# EAGLE design 2_cpu_control (EAGLE 6.6.0)

## Sheet 1 of 2
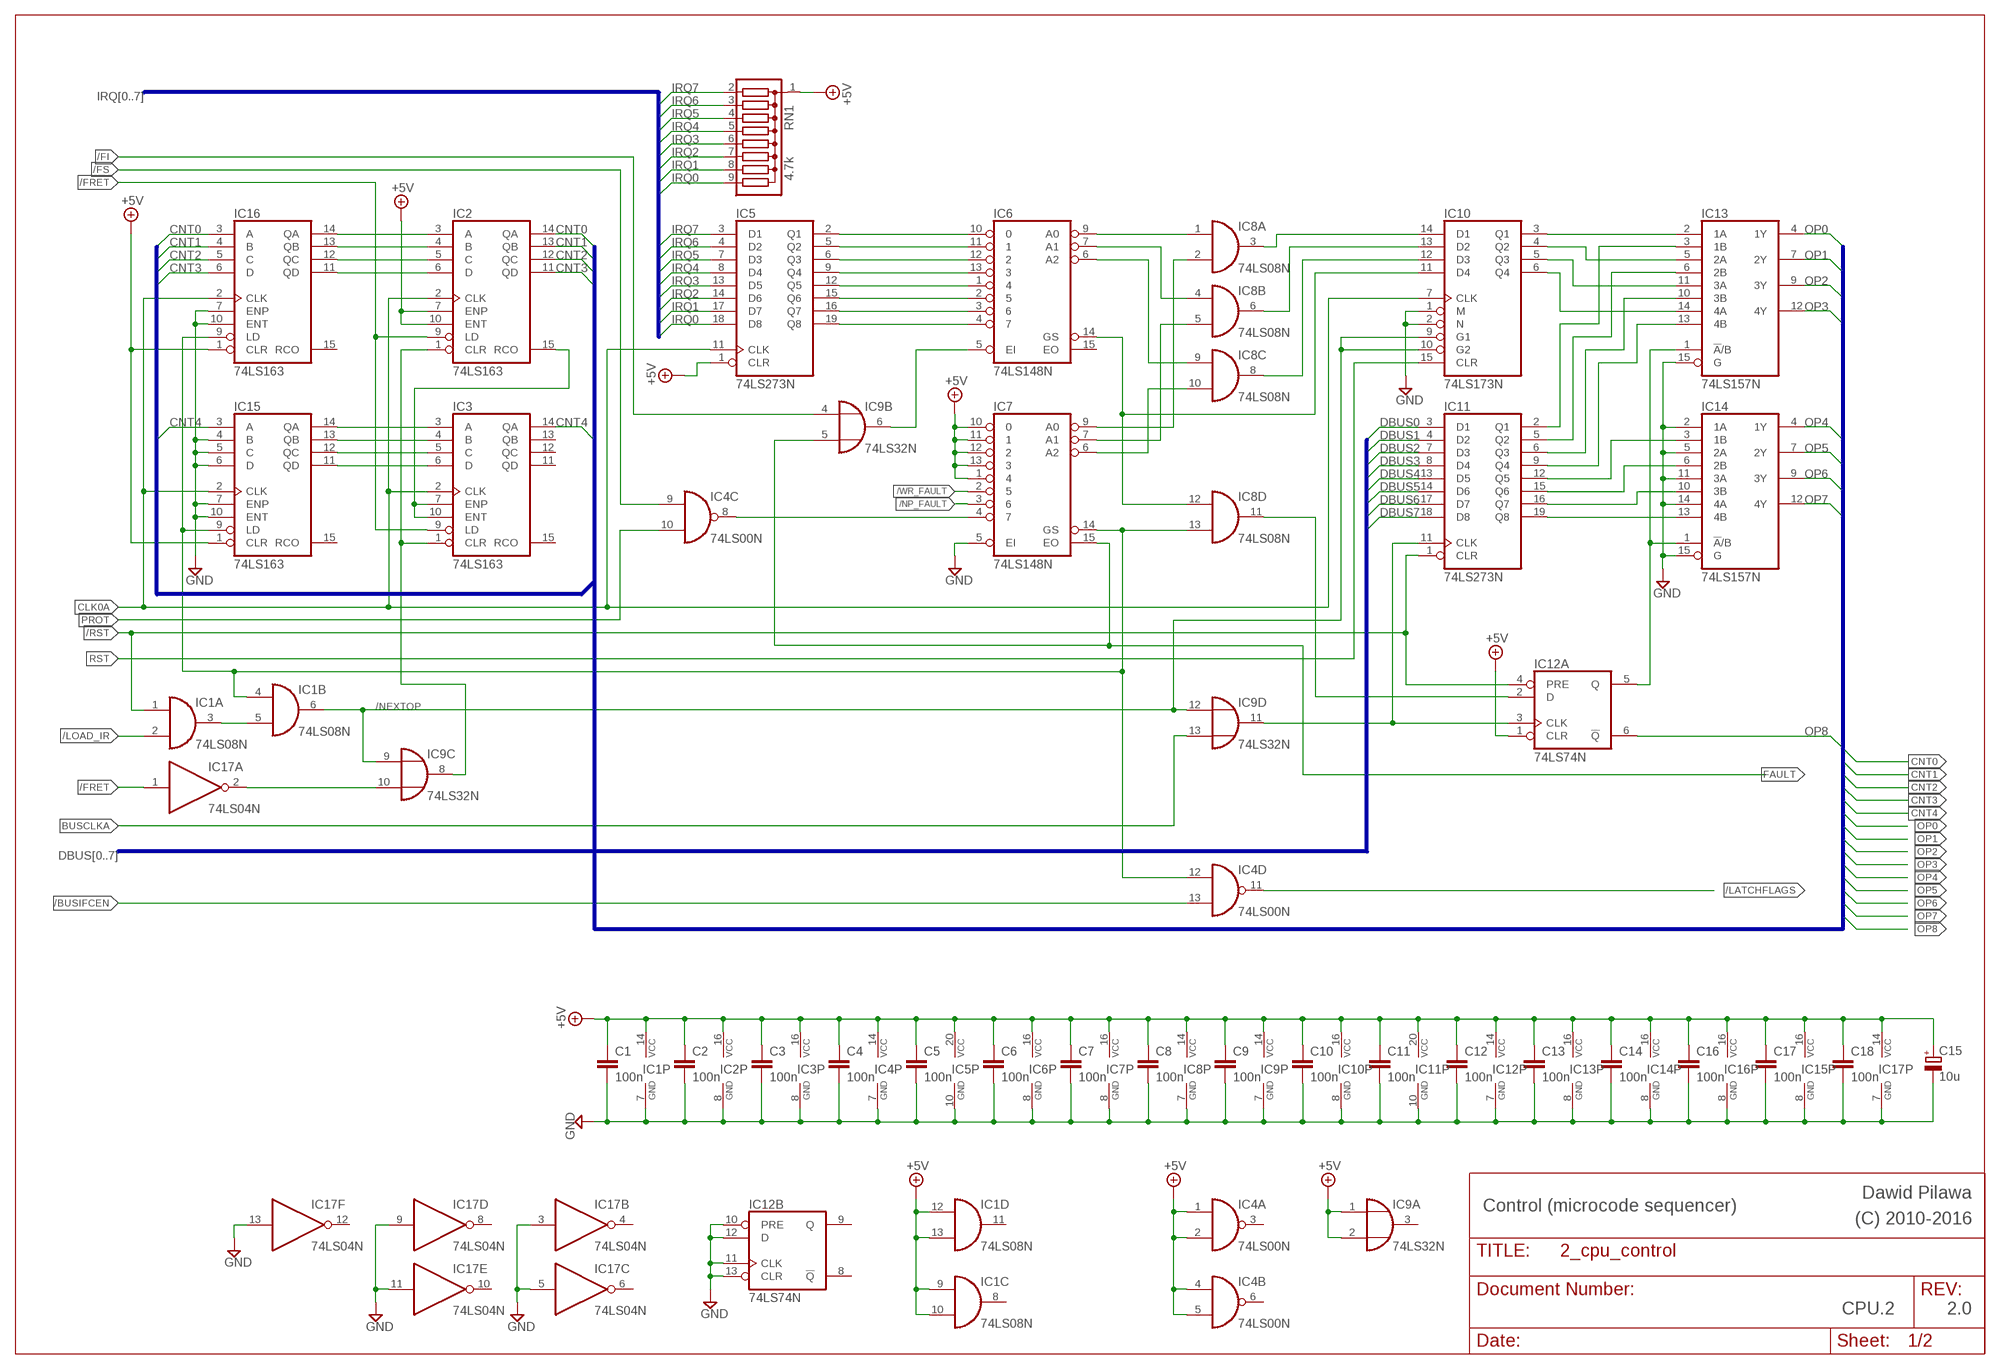
[diagram p0: schematic, sheet 1]

### Parts
C1  100n  C-EU050-024X044  [C050-024X044]
C2  100n  C-EU050-024X044  [C050-024X044]
C3  100n  C-EU050-024X044  [C050-024X044]
C4  100n  C-EU050-024X044  [C050-024X044]
C5  100n  C-EU050-024X044  [C050-024X044]
C6  100n  C-EU050-024X044  [C050-024X044]
C7  100n  C-EU050-024X044  [C050-024X044]
C8  100n  C-EU050-024X044  [C050-024X044]
C9  100n  C-EU050-024X044  [C050-024X044]
C10  100n  C-EU050-024X044  [C050-024X044]
C11  100n  C-EU050-024X044  [C050-024X044]
C12  100n  C-EU050-024X044  [C050-024X044]
C13  100n  C-EU050-024X044  [C050-024X044]
C14  100n  C-EU050-024X044  [C050-024X044]
C15  10u  CPOL-EUE5-6  [E5-6]
C16  100n  C-EU050-024X044  [C050-024X044]
C17  100n  C-EU050-024X044  [C050-024X044]
C18  100n  C-EU050-024X044  [C050-024X044]
IC1  74LS08N  [DIL14]
IC2  74LS163  74160N  [DIL16]
IC3  74LS163  74160N  [DIL16]
IC4  74LS00N  [DIL14]
IC5  74LS273N  74273N  [DIL20]
IC6  74LS148N  [DIL16]
IC7  74LS148N  [DIL16]
IC8  74LS08N  [DIL14]
IC9  74LS32N  [DIL14]
IC10  74LS173N  [DIL16]
IC11  74LS273N  74273N  [DIL20]
IC12  74LS74N  [DIL14]
IC13  74LS157N  [DIL16]
IC14  74LS157N  [DIL16]
IC15  74LS163  74160N  [DIL16]
IC16  74LS163  74160N  [DIL16]
IC17  74LS04N  [DIL14]
RN1  4.7k  G08R  [SIL9]

### Nets
+5V: C1.1 C2.1 C3.1 C4.1 C5.1 C6.1 C7.1 C8.1 C9.1 C10.1 C11.1 C12.1 C13.1 C14.1 C15.+ C16.1 C17.1 C18.1 IC1.9(C:I0) IC1.10(C:I1) IC1.12(D:I0) IC1.13(D:I1) IC1.14(P:VCC) IC2.7(ENP) IC2.10(ENT) IC2.16(VCC) IC3.16(VCC) IC4.1(A:I0) IC4.2(A:I1) IC4.4(B:I0) IC4.5(B:I1) IC4.14(P:VCC) IC5.1(CLR) IC5.20(VCC) IC6.16(VCC) IC7.1 IC7.10 IC7.11 IC7.12 IC7.13 IC7.16(VCC) IC8.14(P:VCC) IC9.1(A:I0) IC9.2(A:I1) IC9.14(P:VCC) IC10.16(VCC) IC11.20(VCC) IC12.1(A:CLR) IC12.14(P:VCC) IC13.16(VCC) IC14.16(VCC) IC15.1(CLR) IC15.16(VCC) IC16.1(CLR) IC16.16(VCC) IC17.14(P:VCC) RN1.1 ; also sheet 2
/BUSIFCEN: IC4.13(D:I1) ; also sheet 2
/FAULT_PF: IC4.8(C:O) IC7.4
/FI: IC9.4(B:I0) ; also sheet 2
/FRET: IC2.9(LD) IC3.9(LD) IC17.1(A:I) ; also sheet 2
/FS: IC4.9(C:I0) ; also sheet 2
/LATCHFLAGS: IC4.11(D:O) ; also sheet 2
/LOAD_IR: IC1.2(A:I1) ; also sheet 2
/NEXTOP: IC1.6(B:O) IC9.9(C:I0) IC9.12(D:I0) IC10.9(G1) IC10.10(G2)
/NP_FAULT: IC7.3 ; also sheet 2
/RST: IC1.1(A:I0) IC11.1(CLR) IC12.4(A:PRE) ; also sheet 2
/WR_FAULT: IC7.2 ; also sheet 2
BUSCLKA: IC9.13(D:I1) ; also sheet 2
CLK0A: IC2.2(CLK) IC3.2(CLK) IC5.11(CLK) IC10.7(CLK) IC15.2(CLK) IC16.2(CLK) ; also sheet 2
CNT0: IC2.14(QA) IC16.3(A) ; also sheet 2
CNT1: IC2.13(QB) IC16.4(B) ; also sheet 2
CNT2: IC2.12(QC) IC16.5(C) ; also sheet 2
CNT3: IC2.11(QD) IC16.6(D) ; also sheet 2
CNT4: IC3.14(QA) IC15.3(A) ; also sheet 2
DBUS0: IC11.3(D1) ; also sheet 2
DBUS1: IC11.4(D2) ; also sheet 2
DBUS2: IC11.7(D3) ; also sheet 2
DBUS3: IC11.8(D4) ; also sheet 2
DBUS4: IC11.13(D5) ; also sheet 2
DBUS5: IC11.14(D6) ; also sheet 2
DBUS6: IC11.17(D7) ; also sheet 2
DBUS7: IC11.18(D8) ; also sheet 2
FAULT: IC7.15(EO) IC9.5(B:I1) ; also sheet 2
GND: C1.2 C2.2 C3.2 C4.2 C5.2 C6.2 C7.2 C8.2 C9.2 C10.2 C11.2 C12.2 C13.2 C14.2 C15.- C16.2 C17.2 C18.2 IC1.7(P:GND) IC2.8(GND) IC3.8(GND) IC4.7(P:GND) IC5.10(GND) IC6.8(GND) IC7.5(EI) IC7.8(GND) IC8.7(P:GND) IC9.7(P:GND) IC10.1(M) IC10.2(N) IC10.8(GND) IC11.10(GND) IC12.7(P:GND) IC12.10(B:PRE) IC12.11(B:CLK) IC12.12(B:D) IC12.13(B:CLR) IC13.8(GND) IC13.15(G) IC14.2(1A) IC14.5(2A) IC14.8(GND) IC14.11(3A) IC14.14(4A) IC14.15(G) IC15.4(B) IC15.5(C) IC15.6(D) IC15.7(ENP) IC15.8(GND) IC15.10(ENT) IC16.7(ENP) IC16.8(GND) IC16.10(ENT) IC17.3(B:I) IC17.5(C:I) IC17.7(P:GND) IC17.9(D:I) IC17.11(E:I) IC17.13(F:I) ; also sheet 2
IRQ0: IC5.18(D8) RN1.9 ; also sheet 2
IRQ1: IC5.17(D7) RN1.8 ; also sheet 2
IRQ2: IC5.14(D6) RN1.7 ; also sheet 2
IRQ3: IC5.13(D5) RN1.6 ; also sheet 2
IRQ4: IC5.8(D4) RN1.5 ; also sheet 2
IRQ5: IC5.7(D3) RN1.4 ; also sheet 2
IRQ6: IC5.4(D2) RN1.3 ; also sheet 2
IRQ7: IC5.3(D1) RN1.2 ; also sheet 2
N$1: IC6.9(A0) IC8.1(A:I0)
N$2: IC2.15(RCO) IC3.7(ENP) IC3.10(ENT)
N$3: IC7.9(A0) IC8.2(A:I1)
N$4: IC6.7(A1) IC8.4(B:I0)
N$5: IC7.7(A1) IC8.5(B:I1)
N$6: IC7.6(A2) IC8.10(C:I1)
N$7: IC6.6(A2) IC8.9(C:I0)
N$8: IC1.3(A:O) IC1.5(B:I1)
N$9: IC6.14(GS) IC8.12(D:I0) IC10.11(D4)
N$10: IC1.4(B:I0) IC4.12(D:I0) IC7.14(GS) IC8.13(D:I1) IC15.9(LD) IC16.9(LD)
N$11: IC8.3(A:O) IC10.14(D1)
N$12: IC8.6(B:O) IC10.13(D2)
N$13: IC8.8(C:O) IC10.12(D3)
N$14: IC8.11(D:O) IC12.2(A:D)
N$15: IC9.10(C:I1) IC17.2(A:O)
N$16: IC11.5(Q2) IC13.6(2B)
N$17: IC9.11(D:O) IC11.11(CLK) IC12.3(A:CLK)
N$18: IC10.3(Q1) IC13.2(1A)
N$19: IC10.4(Q2) IC13.5(2A)
N$20: IC10.5(Q3) IC13.11(3A)
N$21: IC10.6(Q4) IC13.14(4A)
N$22: IC11.19(Q8) IC14.13(4B)
N$23: IC11.16(Q7) IC14.10(3B)
N$24: IC11.15(Q6) IC14.6(2B)
N$25: IC11.12(Q5) IC14.3(1B)
N$26: IC11.2(Q1) IC13.3(1B)
N$27: IC6.5(EI) IC9.6(B:O)
N$28: IC11.6(Q3) IC13.10(3B)
N$29: IC3.5(C) IC15.12(QC)
N$30: IC11.9(Q4) IC13.13(4B)
N$31: IC2.5(C) IC16.12(QC)
N$32: IC2.3(A) IC16.14(QA)
N$33: IC2.4(B) IC16.13(QB)
N$34: IC2.6(D) IC16.11(QD)
N$35: IC3.3(A) IC15.14(QA)
N$36: IC3.4(B) IC15.13(QB)
N$37: IC3.6(D) IC15.11(QD)
N$38: IC2.1(CLR) IC3.1(CLR) IC9.8(C:O)
N$47: IC12.5(A:Q) IC13.1(!A!/B) IC14.1(!A!/B)
N$57: IC5.19(Q8) IC6.4
N$58: IC5.16(Q7) IC6.3
N$59: IC5.15(Q6) IC6.2
N$60: IC5.12(Q5) IC6.1
N$61: IC5.9(Q4) IC6.13
N$62: IC5.6(Q3) IC6.12
N$63: IC5.5(Q2) IC6.11
N$64: IC5.2(Q1) IC6.10
OP0: IC13.4(1Y) ; also sheet 2
OP1: IC13.7(2Y) ; also sheet 2
OP2: IC13.9(3Y) ; also sheet 2
OP3: IC13.12(4Y) ; also sheet 2
OP4: IC14.4(1Y) ; also sheet 2
OP5: IC14.7(2Y) ; also sheet 2
OP6: IC14.9(3Y) ; also sheet 2
OP7: IC14.12(4Y) ; also sheet 2
OP8: IC12.6(A:!Q) ; also sheet 2
PROT: IC4.10(C:I1) ; also sheet 2
RST: IC10.15(CLR) ; also sheet 2
Unconnected: IC1.8(C:O) IC1.11(D:O) IC3.11(QD) IC3.12(QC) IC3.13(QB) IC3.15(RCO) IC4.3(A:O) IC4.6(B:O) IC6.15(EO) IC9.3(A:O) IC12.8(B:!Q) IC12.9(B:Q) IC15.15(RCO) IC16.15(RCO) IC17.4(B:O) IC17.6(C:O) IC17.8(D:O) IC17.10(E:O) IC17.12(F:O)

### Buses
DBUS[0..7]
UCADR:OP[0..8],CNT[0..4]
IRQ[0..7]

### Notes on the sheet
- Dawid Pilawa
- Control (microcode sequencer) | (C) 2010-2016
- CPU.2 | 2.0

## Sheet 2 of 2
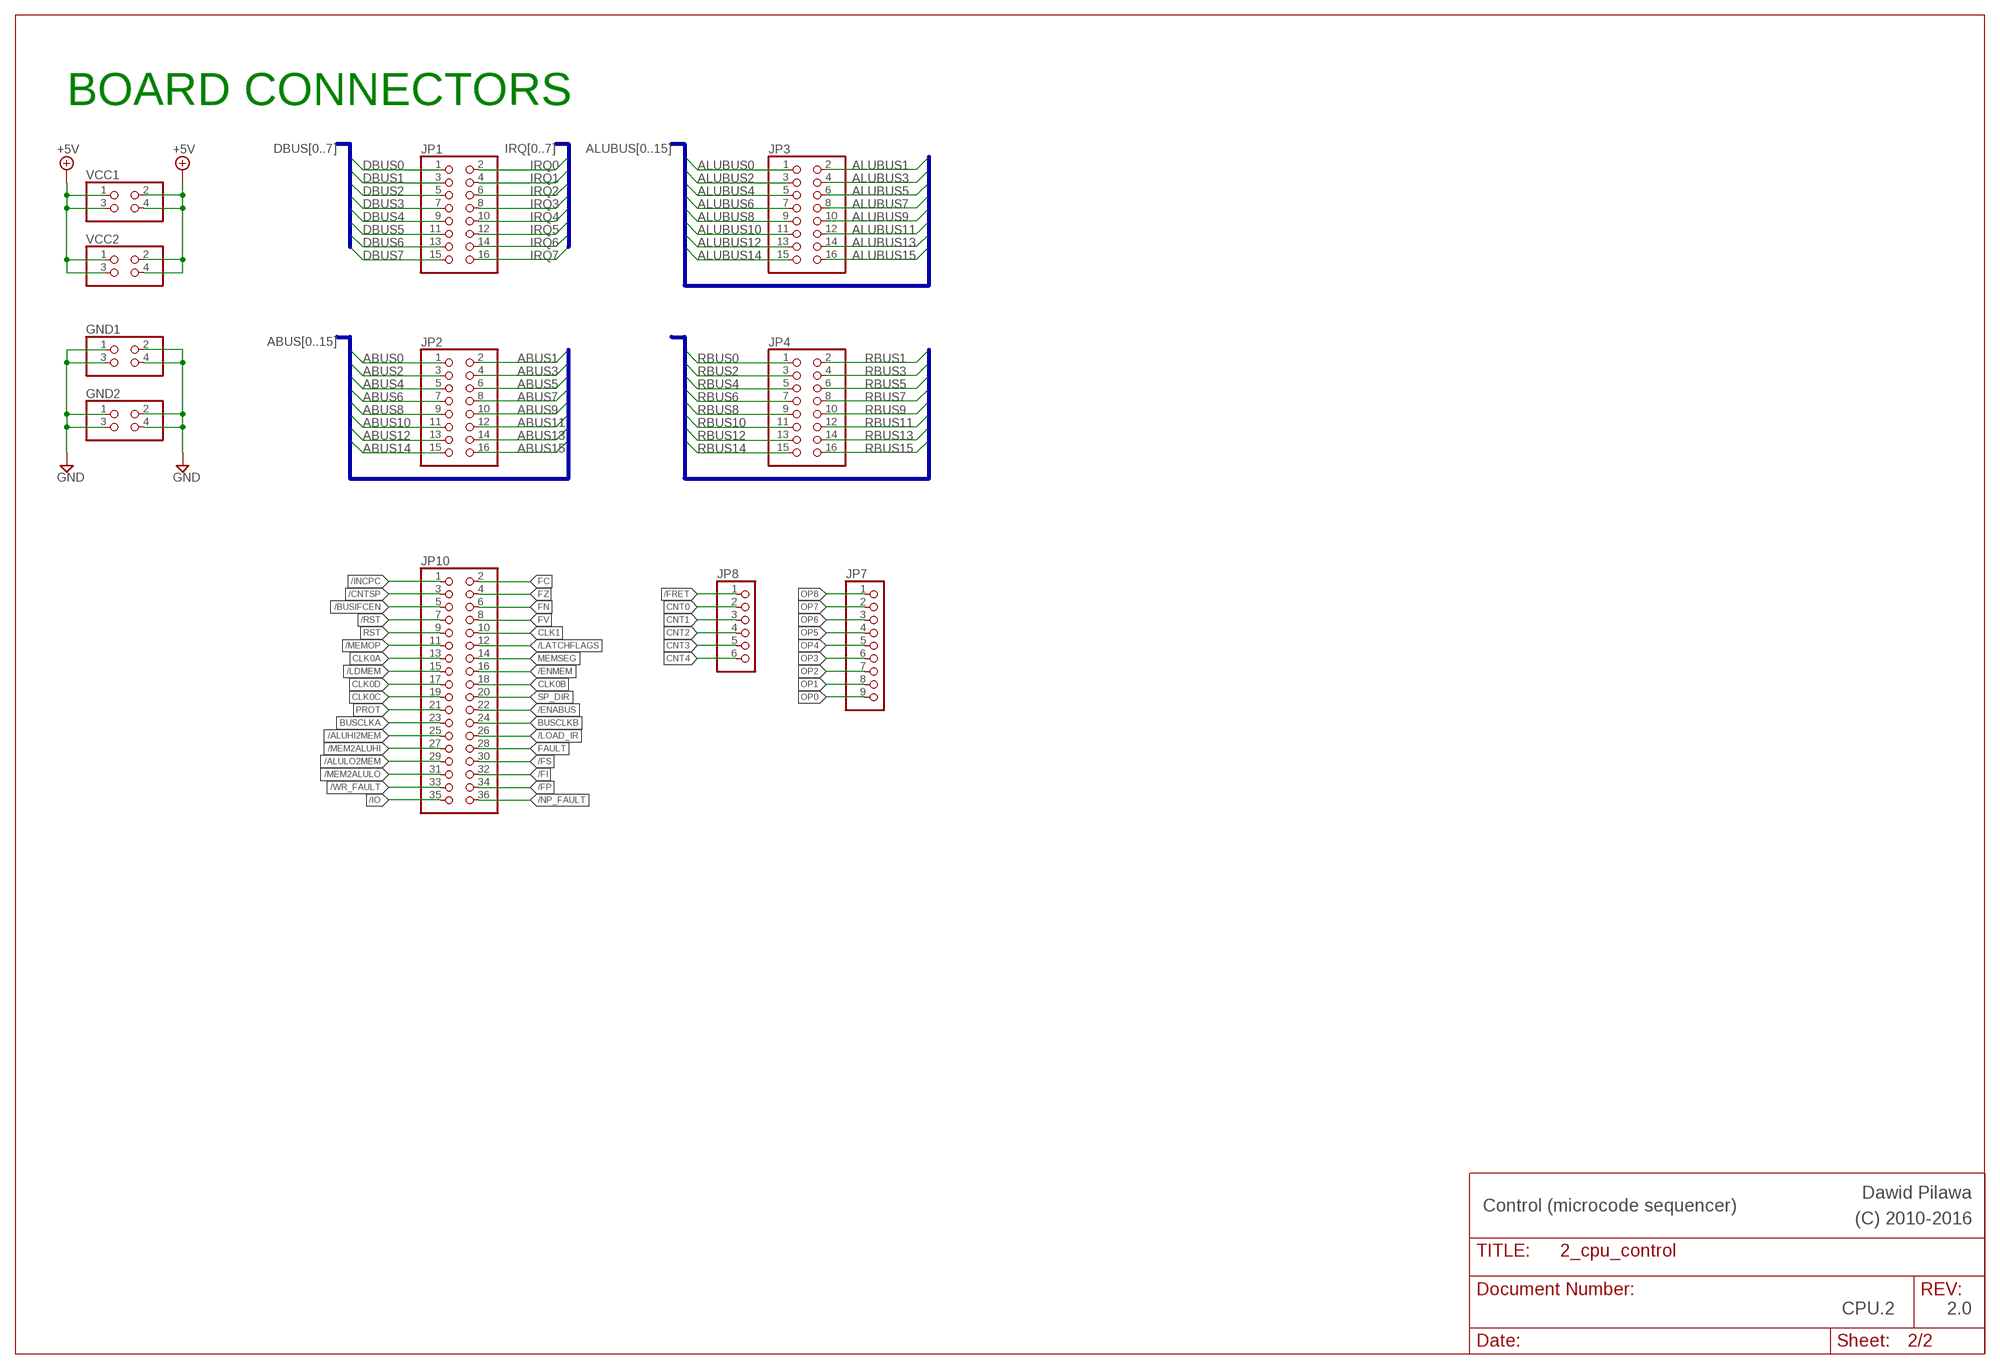
[diagram p1: schematic, sheet 2]

### Parts
GND1  PINHD-2X2  [2X02]
GND2  PINHD-2X2  [2X02]
JP1  PINHD-2X8  [2X08]
JP2  PINHD-2X8  [2X08]
JP3  PINHD-2X8  [2X08]
JP4  PINHD-2X8  [2X08]
JP7  PINHD-1X9  [1X09]
JP8  PINHD-1X6  [1X06]
JP10  PINHD-2X18  [2X18]
VCC1  PINHD-2X2  [2X02]
VCC2  PINHD-2X2  [2X02]

### Nets
+5V: VCC1.1 VCC1.2 VCC1.3 VCC1.4 VCC2.1 VCC2.2 VCC2.3 VCC2.4 ; also sheet 1
/ALUHI2MEM: JP10.25
/ALULO2MEM: JP10.29
/BUSIFCEN: JP10.5 ; also sheet 1
/CNTSP: JP10.3
/ENABUS: JP10.22
/ENMEM: JP10.16
/FI: JP10.32 ; also sheet 1
/FP: JP10.34
/FRET: JP8.1 ; also sheet 1
/FS: JP10.30 ; also sheet 1
/INCPC: JP10.1
/IO: JP10.35
/LATCHFLAGS: JP10.12 ; also sheet 1
/LDMEM: JP10.15
/LOAD_IR: JP10.26 ; also sheet 1
/MEM2ALUHI: JP10.27
/MEM2ALULO: JP10.31
/MEMOP: JP10.11
/NP_FAULT: JP10.36 ; also sheet 1
/RST: JP10.7 ; also sheet 1
/WR_FAULT: JP10.33 ; also sheet 1
ABUS0: JP2.1
ABUS1: JP2.2
ABUS2: JP2.3
ABUS3: JP2.4
ABUS4: JP2.5
ABUS5: JP2.6
ABUS6: JP2.7
ABUS7: JP2.8
ABUS8: JP2.9
ABUS9: JP2.10
ABUS10: JP2.11
ABUS11: JP2.12
ABUS12: JP2.13
ABUS13: JP2.14
ABUS14: JP2.15
ABUS15: JP2.16
ALUBUS0: JP3.1
ALUBUS1: JP3.2
ALUBUS2: JP3.3
ALUBUS3: JP3.4
ALUBUS4: JP3.5
ALUBUS5: JP3.6
ALUBUS6: JP3.7
ALUBUS7: JP3.8
ALUBUS8: JP3.9
ALUBUS9: JP3.10
ALUBUS10: JP3.11
ALUBUS11: JP3.12
ALUBUS12: JP3.13
ALUBUS13: JP3.14
ALUBUS14: JP3.15
ALUBUS15: JP3.16
BUSCLKA: JP10.23 ; also sheet 1
BUSCLKB: JP10.24
CLK0A: JP10.13 ; also sheet 1
CLK0B: JP10.18
CLK0C: JP10.19
CLK0D: JP10.17
CLK1: JP10.10
CNT0: JP8.2 ; also sheet 1
CNT1: JP8.3 ; also sheet 1
CNT2: JP8.4 ; also sheet 1
CNT3: JP8.5 ; also sheet 1
CNT4: JP8.6 ; also sheet 1
DBUS0: JP1.1 ; also sheet 1
DBUS1: JP1.3 ; also sheet 1
DBUS2: JP1.5 ; also sheet 1
DBUS3: JP1.7 ; also sheet 1
DBUS4: JP1.9 ; also sheet 1
DBUS5: JP1.11 ; also sheet 1
DBUS6: JP1.13 ; also sheet 1
DBUS7: JP1.15 ; also sheet 1
FAULT: JP10.28 ; also sheet 1
FC: JP10.2
FN: JP10.6
FV: JP10.8
FZ: JP10.4
GND: GND1.1 GND1.2 GND1.3 GND1.4 GND2.1 GND2.2 GND2.3 GND2.4 ; also sheet 1
IRQ0: JP1.2 ; also sheet 1
IRQ1: JP1.4 ; also sheet 1
IRQ2: JP1.6 ; also sheet 1
IRQ3: JP1.8 ; also sheet 1
IRQ4: JP1.10 ; also sheet 1
IRQ5: JP1.12 ; also sheet 1
IRQ6: JP1.14 ; also sheet 1
IRQ7: JP1.16 ; also sheet 1
MEMSEG: JP10.14
OP0: JP7.9 ; also sheet 1
OP1: JP7.8 ; also sheet 1
OP2: JP7.7 ; also sheet 1
OP3: JP7.6 ; also sheet 1
OP4: JP7.5 ; also sheet 1
OP5: JP7.4 ; also sheet 1
OP6: JP7.3 ; also sheet 1
OP7: JP7.2 ; also sheet 1
OP8: JP7.1 ; also sheet 1
PROT: JP10.21 ; also sheet 1
RBUS0: JP4.1
RBUS1: JP4.2
RBUS2: JP4.3
RBUS3: JP4.4
RBUS4: JP4.5
RBUS5: JP4.6
RBUS6: JP4.7
RBUS7: JP4.8
RBUS8: JP4.9
RBUS9: JP4.10
RBUS10: JP4.11
RBUS11: JP4.12
RBUS12: JP4.13
RBUS13: JP4.14
RBUS14: JP4.15
RBUS15: JP4.16
RST: JP10.9 ; also sheet 1
SP_DIR: JP10.20

### Buses
DBUS[0..7]
IRQ[0..7]
ALUBUS[0..15]
RBUS[0..15]
ABUS[0..15]

### Notes on the sheet
- BOARD CONNECTORS
- Dawid Pilawa
- Control (microcode sequencer) | (C) 2010-2016
- CPU.2 | 2.0

## Library data of the parts
C1-C14 C16-C18 = rcl:C-EU: CAPACITOR, European symbol
C15 = rcl:CPOL-EU: POLARIZED CAPACITOR, European symbol
GND1 GND2 VCC1 VCC2 = pinhead:PINHD-2X2: PIN HEADER
IC1 IC8 = 74xx-eu:74*08: Quad 2-input AND gate
IC2 IC3 IC15 IC16 = 74xx-eu:74*160: Synchronous 4-bit COUNTER
IC4 = 74xx-eu:74*00: Quad 2-input NAND gate
IC5 IC11 = 74xx-eu:74*273: Octal D type FLIP FLOP, clear
IC6 IC7 = 74xx-eu:74*148: 10-line to 4-line and 8-line to 3-line PRIORITY ENCODER
IC9 = 74xx-eu:74*32: Quad 2-input OR gate
IC10 = 74xx-eu:74*173: 4-bit D type REGISTER, 3-state
IC12 = 74xx-eu:74*74: Dual D type positive edge triggered FLIP FLOP, preset and clear
IC13 IC14 = 74xx-eu:74*157: Quadruple 2-line to 1-line data SELECTOR/MULTIPLEXER
IC17 = 74xx-eu:74*04: Hex INVERTER
JP1-JP4 = pinhead:PINHD-2X8: PIN HEADER
JP7 = pinhead:PINHD-1X9: PIN HEADER
JP8 = pinhead:PINHD-1X6: PIN HEADER
JP10 = pinhead:PINHD-2X18: PIN HEADER
RN1 = resistor-sil:G08R: SIL RESISTOR

## Board
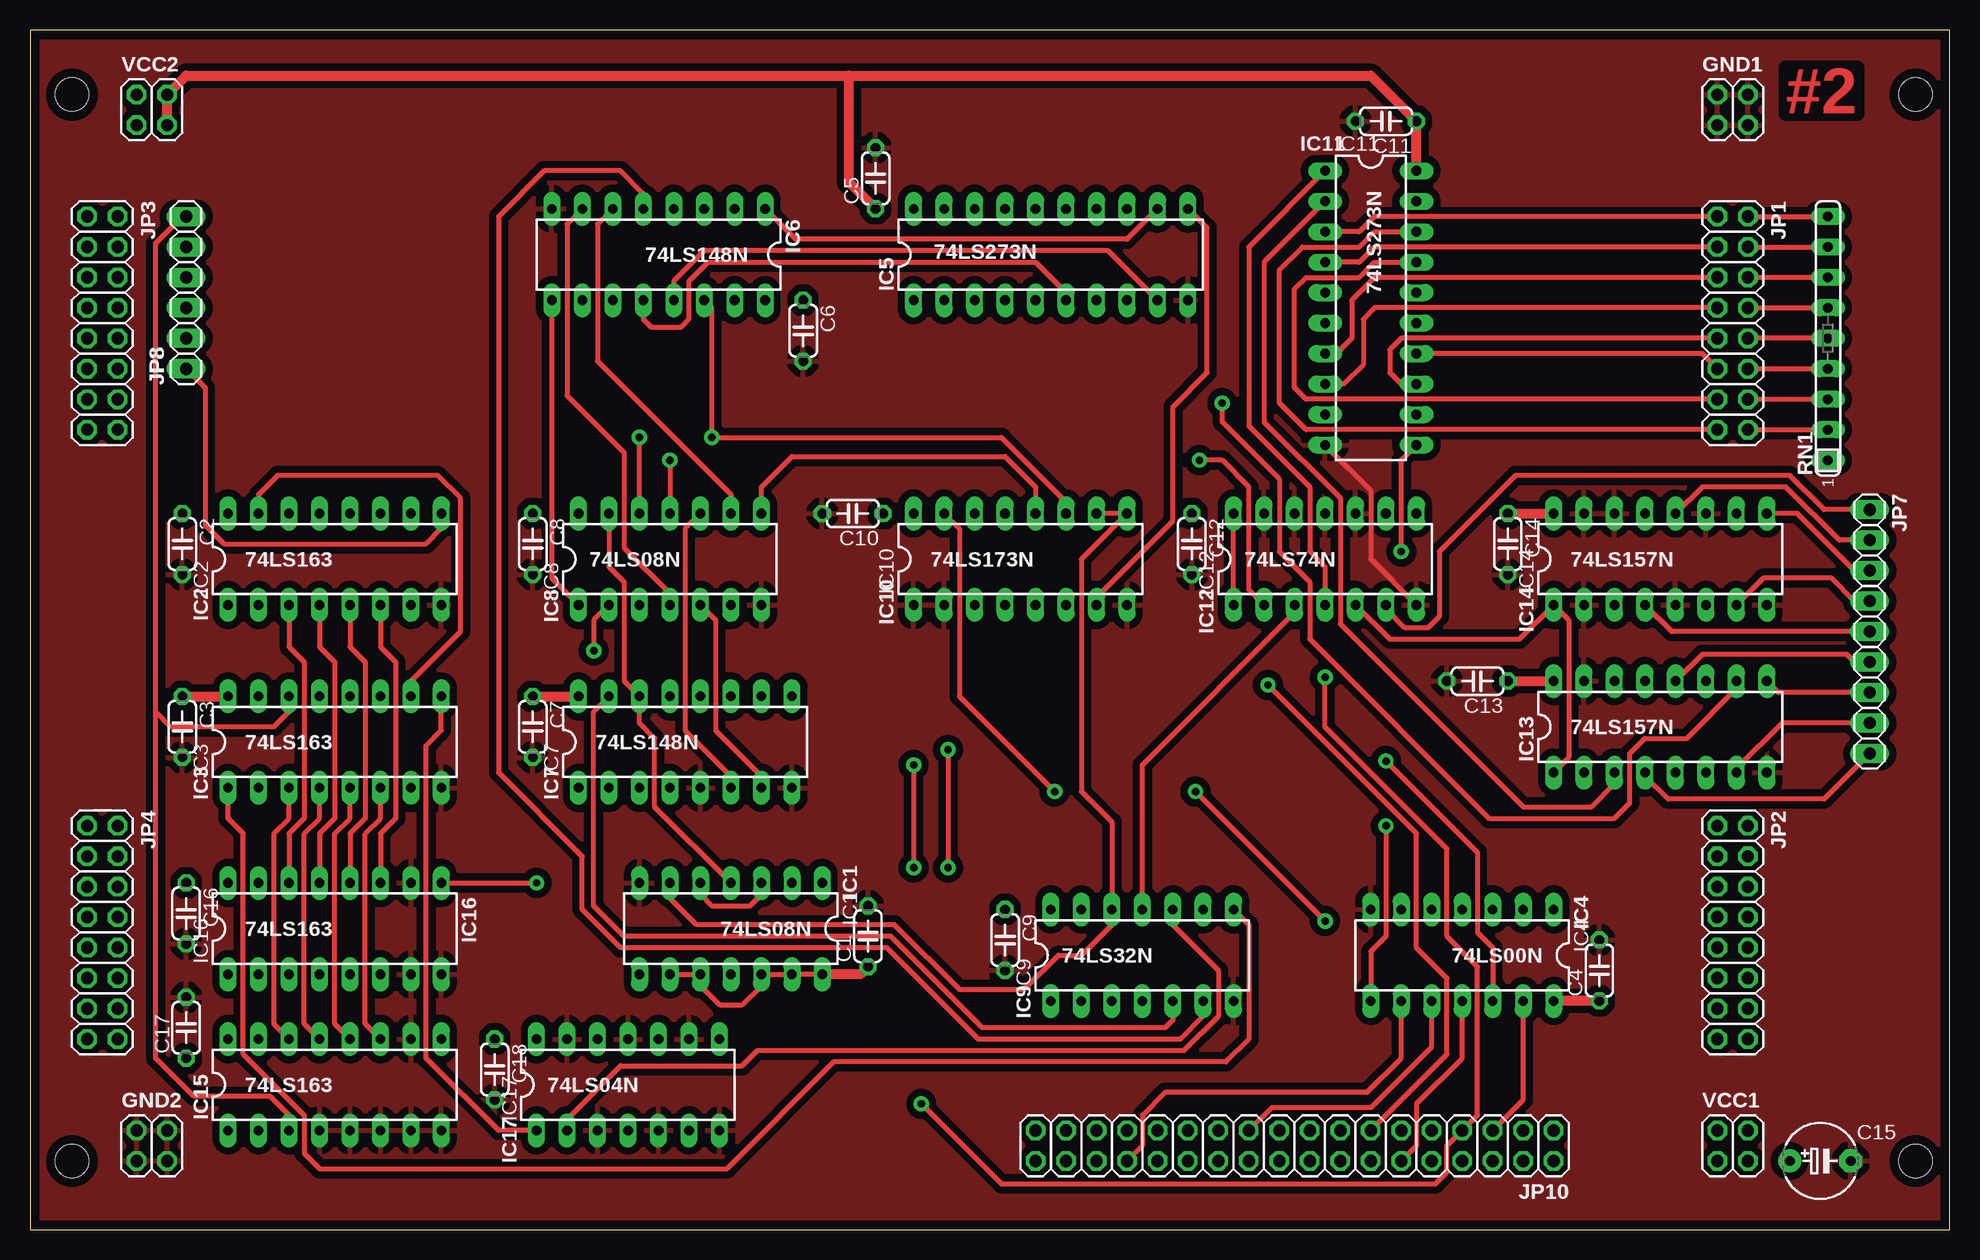
[diagram p2: board, top side]
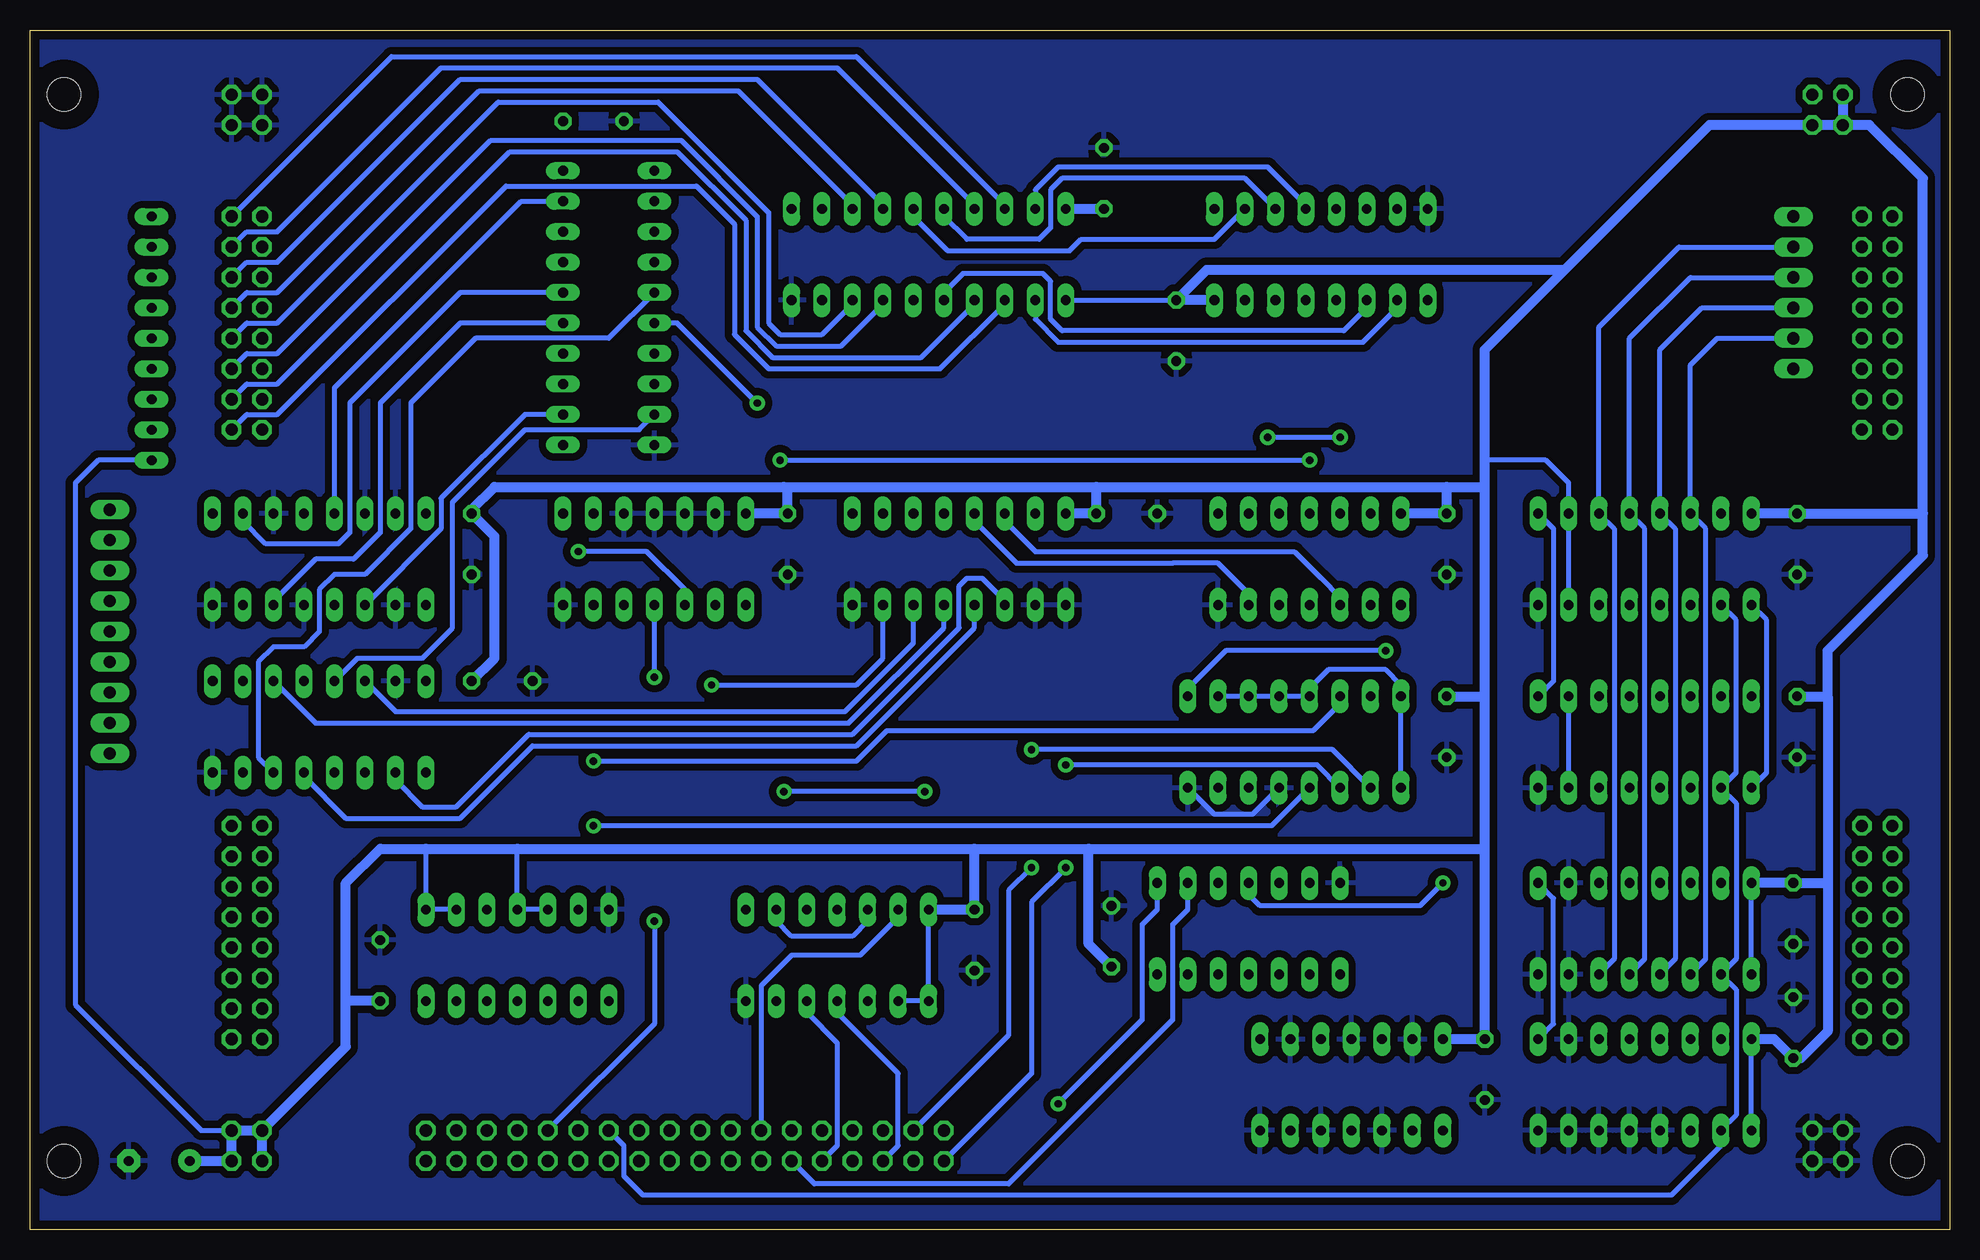
[diagram p3: board, bottom side, seen from below]

Size 160 x 100 mm. Coordinates in mm from the lower left corner, seen from the top.
Outline: 0,0 160,0 160,100 0,100 0,0
Copper layers (1*16): Top 0.035mm / dielectric 1.5mm / Bottom 0.035mm
Design rules "homebrew_pcb": minimum track width 16mil, minimum drill 24mil, track to track 16mil, track to pad 10mil, pad to pad 10mil, via to via 10mil, smd to smd 8mil, copper to edge 30mil, drill to drill 10mil, minimum pad ring 12mil, minimum via ring 12mil, stop-mask expansion 4mil, vias tented up to drill 0mil, thermal gap 24mil
Holes 2.79 mm at 3.49,94.61 3.49,5.71 157.16,94.61 157.16,5.71
bRestrict: area 1.2,92.3 to 5.8,96.9; area 154.9,92.3 to 159.4,96.9; area 154.9,3.4 to 159.4,8; area 1.2,3.4 to 5.8,8
vRestrict: area 1.2,92.3 to 5.8,96.9; area 1.2,3.4 to 5.8,8; area 154.9,3.4 to 159.4,8; area 154.9,92.3 to 159.4,96.9

### Footprints (pad centres in the part's own frame; a part is rotated, then mirrored left to right if it is on the bottom)
C050-024X044 = drill 0.813 octagon: 1 -2.54,0; 2 2.54,0
E5-6 = drill 0.813 pad 1.905: + -2.54,0 | drill 0.813 pad 1.905 octagon: - 2.54,0
2X02 = drill 1.016 octagon: 1 -1.27,-1.27; 2 -1.27,1.27; 3 1.27,-1.27; 4 1.27,1.27
DIL14 = drill 0.813 long: 1 -7.62,-3.81; 2 -5.08,-3.81; 3 -2.54,-3.81; 4 0,-3.81; 5 2.54,-3.81; 6 5.08,-3.81; 7 7.62,-3.81; 8 7.62,3.81; 9 5.08,3.81; 10 2.54,3.81; 11 0,3.81; 12 -2.54,3.81; 13 -5.08,3.81; 14 -7.62,3.81
DIL16 = drill 0.813 long: 1 -8.89,-3.81; 2 -6.35,-3.81; 3 -3.81,-3.81; 4 -1.27,-3.81; 5 1.27,-3.81; 6 3.81,-3.81; 7 6.35,-3.81; 8 8.89,-3.81; 9 8.89,3.81; 10 6.35,3.81; 11 3.81,3.81; 12 1.27,3.81; 13 -1.27,3.81; 14 -3.81,3.81; 15 -6.35,3.81; 16 -8.89,3.81
DIL20 = drill 0.813 long: 1 -11.43,-3.81; 2 -8.89,-3.81; 3 -6.35,-3.81; 4 -3.81,-3.81; 5 -1.27,-3.81; 6 1.27,-3.81; 7 3.81,-3.81; 8 6.35,-3.81; 9 8.89,-3.81; 10 11.43,-3.81; 11 11.43,3.81; 12 8.89,3.81; 13 6.35,3.81; 14 3.81,3.81; 15 1.27,3.81; 16 -1.27,3.81; 17 -3.81,3.81; 18 -6.35,3.81; 19 -8.89,3.81; 20 -11.43,3.81
2X08 = drill 1.016 octagon: 1 -8.89,-1.27; 2 -8.89,1.27; 3 -6.35,-1.27; 4 -6.35,1.27; 5 -3.81,-1.27; 6 -3.81,1.27; 7 -1.27,-1.27; 8 -1.27,1.27; 9 1.27,-1.27; 10 1.27,1.27; 11 3.81,-1.27; 12 3.81,1.27; 13 6.35,-1.27; 14 6.35,1.27; 15 8.89,-1.27; 16 8.89,1.27
1X09 = drill 1.016 long: 1 -10.16,0; 2 -7.62,0; 3 -5.08,0; 4 -2.54,0; 5 0,0; 6 2.54,0; 7 5.08,0; 8 7.62,0; 9 10.16,0
1X06 = drill 1.016 long: 1 -6.35,0; 2 -3.81,0; 3 -1.27,0; 4 1.27,0; 5 3.81,0; 6 6.35,0
2X18 = drill 1.016 octagon: 1 -21.59,-1.27; 2 -21.59,1.27; 3 -19.05,-1.27; 4 -19.05,1.27; 5 -16.51,-1.27; 6 -16.51,1.27; 7 -13.97,-1.27; 8 -13.97,1.27; 9 -11.43,-1.27; 10 -11.43,1.27; 11 -8.89,-1.27; 12 -8.89,1.27; 13 -6.35,-1.27; 14 -6.35,1.27; 15 -3.81,-1.27; 16 -3.81,1.27; 17 -1.27,-1.27; 18 -1.27,1.27; 19 1.27,-1.27; 20 1.27,1.27; 21 3.81,-1.27; 22 3.81,1.27; 23 6.35,-1.27; 24 6.35,1.27; 25 8.89,-1.27; 26 8.89,1.27; 27 11.43,-1.27; 28 11.43,1.27; 29 13.97,-1.27; 30 13.97,1.27; 31 16.51,-1.27; 32 16.51,1.27; 33 19.05,-1.27; 34 19.05,1.27; 35 21.59,-1.27; 36 21.59,1.27
SIL9 = drill 0.813 long: 1 -10.16,0; 2 -7.62,0; 3 -5.08,0; 4 -2.54,0; 5 0,0; 6 2.54,0; 7 5.08,0; 8 7.62,0; 9 10.16,0

### Placement (x,y rotation side)
C1  69.85,24.45 90 top
C2  12.7,57.15 270 top
C3  12.7,41.91 270 top
C4  130.81,21.59 90 top
C5  70.48,87.63 90 top
C6  64.45,74.93 270 top
C7  41.91,41.91 270 top
C8  41.91,57.15 270 top
C9  81.28,24.13 270 top
C10  68.58,59.69 180 top
C11  113.03,92.39 180 top
C12  96.84,57.15 270 top
C13  120.65,45.72 180 top
C14  123.19,57.15 270 top
C15  149.22,5.71 0 top
C16  13.02,26.35 270 top
C17  13.02,16.83 90 top
C18  38.73,13.34 270 top
GND1  141.92,93.34 0 top
GND2  10.16,6.99 0 top
IC1  58.42,25.08 180 top
IC2  25.4,55.88 0 top
IC3  25.4,40.64 0 top
IC4  119.38,22.86 180 top
IC5  85.09,81.28 0 top
IC6  52.39,81.28 180 top
IC7  54.61,40.64 0 top
IC8  53.34,55.88 0 top
IC9  92.71,22.86 0 top
IC10  82.55,55.88 0 top
IC11  111.76,76.83 270 top
IC12  107.95,55.88 0 top
IC13  135.89,41.91 0 top
IC14  135.89,55.88 0 top
IC15  25.4,12.06 0 top
IC16  25.4,25.08 0 top
IC17  49.85,12.06 0 top
JP1  141.92,75.56 270 top
JP2  141.92,24.77 270 top
JP3  6.03,75.56 270 top
JP4  6.03,24.77 270 top
JP7  153.35,49.85 270 top
JP8  13.02,78.11 90 top
JP10  105.41,6.99 180 top
RN1  149.86,74.3 90 top
VCC1  141.92,6.99 0 top
VCC2  10.16,93.34 0 top

### Tracks (layer width: path | path; a pad name or v marks a point on that pad's centre or on a via)
+5V
  Top 0.406: IC1.9 IC1.10 55.88,20.32 57.47,18.73 59.37,18.73 60.96,20.32 IC1.12 IC1.13 IC1.14 | IC12.1 IC12.14
  Top 0.813: 68.26,96.2 13.02,96.2 VCC2.4 VCC2.3 | 68.26,96.2 111.76,96.2 C11.1 IC11.20 | C4.1 IC4.14 | C3.1 IC3.16 | C14.1 IC14.16 | C13.1 IC13.16 | C5.1 68.26,87.31 68.26,96.2 | C7.1 IC7.16 | C1.1 69.22,21.27 IC1.14
  Bottom 0.406: RN1.1 154.31,64.14 156.21,62.23 156.21,18.73 145.73,8.26 VCC1.4 | IC4.5 IC4.4 119.38,31.75 | IC5.1 C6.1 | IC7.1 IC7.16 45.72,45.4 46.99,46.67 51.75,46.67 53.34,45.09 IC7.13 IC7.12 IC7.11 IC7.10 | IC9.14 IC9.1 IC9.2 | IC4.2 IC4.1 127,31.75 | IC15.1 IC15.16 | IC16.1 IC16.16 | IC2.7 IC2.10 31.75,62.23 33.66,64.14 38.73,64.14
  Bottom 0.813: VCC1.2 133.67,15.24 133.67,19.05 | 133.67,19.05 133.67,28.89 130.81,31.75 127,31.75 119.38,31.75 81.28,31.75 | 81.28,31.75 71.75,31.75 | 71.75,31.75 38.73,31.75 | 10.16,44.45 10.16,48.26 2.22,56.2 2.22,59.69 | 2.22,59.69 2.22,87.63 6.67,92.08 VCC2.1 | VCC2.1 VCC2.3 20,92.08 32.07,80.01 | VCC2.2 VCC2.1 | VCC1.1 VCC1.2 | VCC1.2 VCC1.4 VCC1.3 C15.+ | C4.1 133.67,19.05 | 81.28,31.75 C9.1 IC9.14 | C3.1 10.16,44.45 | 2.22,59.69 C2.1 IC2.16 | 97.16,61.91 121.28,61.91 123.19,60.01 C14.1 121.28,57.78 121.28,47.62 C13.1 | 97.16,61.91 71.12,61.91 | 71.12,61.91 41.91,61.91 | 41.91,61.91 C8.1 IC8.14 | 71.12,61.91 C10.1 IC10.16 | 97.16,61.91 96.84,61.59 C12.1 IC12.14 | IC5.20 C5.1 | 32.07,80.01 61.91,80.01 C6.1 IC6.16 | 10.16,44.45 10.16,28.89 | 10.16,28.89 10.16,16.51 12.38,14.29 C17.1 14.61,15.88 IC15.16 | 10.16,28.89 C16.1 IC16.16 | 38.73,31.75 C18.1 IC17.14 | 32.07,80.01 38.73,73.34 38.73,64.14 38.73,61.91 | 38.73,31.75 38.73,44.45 | 38.73,44.45 38.73,61.91 | 41.91,61.91 38.73,61.91 | C7.1 38.73,44.45 | C1.1 71.75,23.81 71.75,31.75
/BUSIFCEN
  Top 0.406: JP10.5 124.46,10.79 IC4.13
/FAULT_PF  (via drill 0.61 pad 1.27)
  Top 0.406: v113.03,33.66 113.03,24.45 111.76,23.18 IC4.8
  Bottom 0.406: IC7.4 56.52,33.66 v113.03,33.66
/FI
  Bottom 0.406: JP10.32 87.63,6.99 87.63,13.02 92.71,18.1 IC9.4
/FRET
  Top 0.406: JP8.1 14.61,70.17 14.61,58.74 16.19,57.15 33.02,57.15 34.29,58.42 IC2.9 | IC17.1 39.05,8.26 33.02,14.29 33.02,40.32 34.29,41.59 IC3.9
  Bottom 0.406: IC2.9 33.02,58.42 33.02,45.72 IC3.9
/FS
  Top 0.406: JP10.30 92.71,6.99 92.71,9.53 94.61,11.43 111.44,11.43 114.3,14.29 IC4.9
/LATCHFLAGS
  Top 0.406: JP10.12 115.57,6.99 115.57,10.48 119.38,14.29 IC4.11 119.38,18.73
/LOAD_IR
  Bottom 0.406: JP10.26 94.61,3.81 78.42,3.81 64.77,17.46 64.77,25.4 63.5,26.67 IC1.2
/NEXTOP
  Top 0.406: IC10.10 IC10.9 87.63,55.88 87.63,36.51 90.17,33.97 IC9.12 90.17,25.4 87.63,22.86 85.72,22.86 82.87,20 77.47,20 72.07,25.4 55.56,25.4 53.34,27.62 IC1.6
  Bottom 0.406: IC9.12 90.17,25.72 91.44,24.45 96.52,24.45 97.79,25.72 IC9.9
/NP_FAULT  (via drill 0.61 pad 1.27)
  Top 0.406: v73.66,38.73 v73.66,30.16
  Bottom 0.406: IC7.3 52.7,38.73 v73.66,38.73 | v73.66,30.16 76.52,27.3 76.52,13.02 JP10.36
/RST  (via drill 0.61 pad 1.27)
  Top 0.406: IC11.1 101.6,81.92 101.6,66.99 106.68,61.91 106.68,56.52 107.95,55.24 IC12.4 | v74.3,10.48 80.96,3.81 117.16,3.81 118.11,4.76 118.11,6.99 JP10.7 120.65,9.53 120.65,21.91 118.11,24.45 118.11,31.75 107.95,41.91 v107.95,46.04
  Bottom 0.406: v107.95,46.04 IC12.4 | v74.3,10.48 67.31,17.46 67.31,25.4 66.04,26.67 IC1.1
/WR_FAULT  (via drill 0.61 pad 1.27)
  Top 0.406: v76.52,40.01 v76.52,30.16
  Bottom 0.406: IC7.2 51.44,40.01 v76.52,40.01 | v76.52,30.16 78.42,28.26 78.42,16.19 JP10.33
BUSCLKA
  Bottom 0.406: IC9.13 87.63,26.04 90.81,22.86 96.52,22.86 99.06,20.32 JP10.23
CLK0A  (via drill 0.61 pad 1.27)
  Top 0.406: IC10.7 88.9,52.7 95.25,59.05 95.25,68.58 98.11,71.44 98.11,83.5 IC5.11 | JP10.13 118.11,14.61 118.11,20.95 115.57,23.5 115.57,33.02 v103.19,45.4
  Bottom 0.406: IC2.2 17.78,50.8 17.78,38.1 IC3.2 17.78,35.56 17.78,22.54 IC16.2 17.78,20 17.78,9.53 IC15.2 19.05,6.99 23.18,2.86 108.9,2.86 110.49,4.45 110.49,6.99 JP10.13 | v103.19,45.4 91.12,45.4 88.9,47.62 IC10.7
CNT0
  Bottom 0.406: JP8.2 19.37,74.3 21.59,72.07 IC2.14 20.32,58.42 20.32,22.54 IC16.3
CNT1
  Bottom 0.406: JP8.3 20.64,76.83 24.13,73.34 IC2.13 22.86,58.42 22.86,22.54 IC16.4
CNT2
  Bottom 0.406: JP8.4 21.59,79.38 26.67,74.3 IC2.12 25.4,58.42 25.4,22.54 IC16.5
CNT3
  Bottom 0.406: JP8.5 22.54,81.92 29.21,75.25 IC2.11 27.94,58.42 27.94,22.54 IC16.6
CNT4
  Top 0.406: JP8.6 12.7,84.45 10.48,82.23 10.48,43.18 | IC3.14 21.59,43.18 20.32,41.91 11.75,41.91 10.48,43.18 | 10.48,43.18 10.48,23.81 10.48,19.37 10.48,14.29 13.65,11.11 20,11.11 21.59,9.53 IC15.3
DBUS0
  Top 0.406: JP1.1 112.08,84.45 110.81,83.19 IC11.3
DBUS1
  Top 0.406: JP1.3 112.08,81.92 110.81,80.64 IC11.4
DBUS2
  Top 0.406: JP1.5 112.08,79.38 110.17,77.47 110.17,74.3 108.9,73.03 IC11.7
DBUS3
  Top 0.406: JP1.7 112.08,76.83 111.12,75.88 111.12,72.07 109.54,70.48 IC11.8
DBUS4
  Top 0.406: JP1.9 114.3,74.3 113.35,73.34 113.35,71.44 114.3,70.48 IC11.13
DBUS5
  Top 0.406: JP1.11 139.38,73.03 IC11.14
DBUS6
  Top 0.406: JP1.13 106.36,69.22 105.41,70.17 105.41,78.42 106.36,79.38 110.81,79.38 112.08,80.64 IC11.17
DBUS7
  Top 0.406: JP1.15 106.36,66.67 104.14,68.9 104.14,80.01 106.05,81.92 110.81,81.92 112.08,83.19 IC11.18
FAULT
  Top 0.406: IC9.5 95.25,17.46 94.61,16.83 79.38,16.83 71.75,24.45 49.53,24.45 46.99,26.99 46.99,43.18 IC7.15
  Bottom 0.406: IC9.5 95.25,18.1 92.71,15.56 92.71,6.99 JP10.28
GND
  Top 0.406: IC11.10 111.76,61.59 111.76,55.88 IC12.7
  Bottom 0.406: IC7.5 58.1,34.61 61.28,34.61 IC7.8
  pour Bottom (isolate 0.61): 0,100.01 160.02,100.01 160.02,89.53 160.02,0 0,0
  pour Top (isolate 0.61): 0,100.01 160.02,100.01 160.02,97.16 160.02,0 0,0
IRQ0
  Top 0.406: JP1.2 RN1.9
  Bottom 0.406: JP1.2 129.86,97.79 91.12,97.79 78.74,85.41 IC5.18
IRQ1
  Top 0.406: JP1.4 RN1.8
  Bottom 0.406: JP1.4 141.92,83.19 139.38,83.19 125.73,96.84 92.71,96.84 81.28,85.41 IC5.17
IRQ2
  Top 0.406: RN1.7 JP1.6
  Bottom 0.406: JP1.6 141.92,80.64 139.38,80.64 124.14,95.89 99.38,95.89 88.9,85.41 IC5.14
IRQ3
  Top 0.406: JP1.8 RN1.6
  Bottom 0.406: JP1.8 141.92,78.11 139.38,78.11 122.56,94.93 100.97,94.93 91.44,85.41 IC5.13
IRQ4
  Top 0.406: RN1.5 JP1.10
  Bottom 0.406: JP1.10 141.92,75.56 139.38,75.56 120.97,93.98 107.63,93.98 98.42,84.77 98.42,75.56 97.47,74.61 93.98,74.61 91.44,77.15 IC5.8
IRQ5
  Top 0.406: JP1.12 RN1.4
  Bottom 0.406: JP1.12 141.92,73.03 139.38,73.03 121.6,90.81 105.73,90.81 99.38,84.45 99.38,75.25 97.79,73.66 92.39,73.66 88.9,77.15 IC5.7
IRQ6
  Top 0.406: JP1.14 RN1.3
  Bottom 0.406: JP1.14 141.92,70.48 139.38,70.48 120.02,89.85 106.05,89.85 100.33,84.14 100.33,74.93 98.11,72.71 85.72,72.71 81.28,77.15 IC5.4
IRQ7
  Top 0.406: JP1.16 RN1.2
  Bottom 0.406: JP1.16 141.92,67.94 139.38,67.94 120.33,87 104.46,87 101.28,83.82 101.28,74.61 98.42,71.75 84.14,71.75 78.74,77.15 IC5.3
N$1
  Top 0.406: IC6.9 43.5,54.29 IC8.1
N$2
  Top 0.406: IC3.10 31.75,45.72 35.88,49.85 35.88,60.96 33.97,62.87 20.64,62.87 19.05,61.28 IC2.15
  Bottom 0.406: IC3.7 IC3.10
N$3  (via drill 0.61 pad 1.27)
  Top 0.406: IC8.2 46.99,50.8 v46.99,48.26
  Bottom 0.406: v46.99,48.26 60.33,48.26 63.5,45.09 IC7.9
N$4
  Top 0.406: IC6.7 44.77,83.82 44.77,69.53 49.53,64.77 49.53,56.83 53.34,53.02 IC8.4
N$5
  Top 0.406: IC8.5 57.15,50.8 57.15,41.59 60.96,37.78 IC7.7
N$6
  Top 0.406: IC8.10 54.61,58.42 54.61,41.59 58.42,37.78 IC7.6
N$7
  Top 0.406: IC6.6 47.31,83.82 47.31,72.39 58.42,61.28 IC8.9
N$8
  Top 0.406: IC1.5 55.88,27.94 56.83,26.99 60.01,26.99 60.96,27.94 IC1.3
N$9  (via drill 0.61 pad 1.27)
  Top 0.406: IC10.11 86.36,60.64 80.96,66.04 v56.83,66.04 56.83,76.83 IC6.14 | IC8.12 v50.8,66.04
  Bottom 0.406: v50.8,66.04 v56.83,66.04
N$10  (via drill 0.61 pad 1.27)
  Top 0.406: IC8.13 48.26,55.24 49.53,53.98 49.53,45.72 IC7.14 50.8,42.23 52.07,40.96 52.07,35.24 IC1.4 | v113.03,39.05 120.65,31.43 120.65,24.77 121.92,23.5 IC4.12 | IC16.9 v42.23,28.89
  Bottom 0.406: IC7.14 50.8,43.81 53.02,41.59 88.58,41.59 91.12,39.05 v113.03,39.05 | IC15.9 33.02,17.14 33.02,27.62 IC16.9 | v42.23,28.89 44.13,26.99 57.47,26.99 58.42,27.94 IC1.4
N$11
  Bottom 0.406: IC10.14 78.74,59.05 76.2,56.52 54.61,56.52 52.39,54.29 50.8,52.7 IC8.3
N$12
  Bottom 0.406: IC10.13 81.28,59.05 77.79,55.56 64.77,55.56 60.96,55.56 58.42,53.02 IC8.6
N$13
  Top 0.406: IC8.8 60.96,61.91 63.5,64.45 81.28,64.45 83.82,61.91 IC10.12
N$14  (via drill 0.61 pad 1.27)
  Top 0.406: v53.34,64.14 IC8.11 | IC12.2 101.6,53.34 101.6,61.91 99.38,64.14 v97.47,64.14
  Bottom 0.406: v97.47,64.14 v53.34,64.14
N$15
  Top 0.406: IC9.10 95.25,25.4 99.06,21.59 99.06,17.78 96.2,14.92 60.64,14.92 59.37,13.65 49.21,13.65 44.77,9.21 IC17.2
N$16
  Bottom 0.406: IC11.5 111.76,74.3 122.87,74.3 128.27,68.9 128.27,58.42 132.08,54.61 134.62,54.61 135.89,53.34 135.89,49.85 137.16,48.58 139.7,48.58 140.97,47.31 140.97,39.37 IC13.6
N$17  (via drill 0.61 pad 1.27)
  Top 0.406: v114.3,56.52 114.3,64.14 IC11.11 | IC9.11 92.71,38.73 105.41,51.44 IC12.3
  Bottom 0.406: IC12.3 105.41,53.34 108.58,56.52 v114.3,56.52
N$18
  Bottom 0.406: IC10.3 78.74,52.39 80.64,54.29 81.92,54.29 82.55,53.66 82.55,50.16 91.44,41.27 118.43,41.27 124.46,35.24 127.32,35.24 129.54,37.47 IC13.2
N$19
  Bottom 0.406: IC10.4 81.28,50.16 91.12,40.32 118.11,40.32 124.14,34.29 133.67,34.29 137.16,37.78 IC13.5
N$20
  Bottom 0.406: IC13.11 136.21,42.23 91.76,42.23 83.82,50.16 IC10.5
N$21
  Bottom 0.406: IC13.14 129.54,43.18 92.08,43.18 86.36,48.9 IC10.6
N$22
  Bottom 0.406: IC14.13 134.62,70.17 119.06,85.72 IC11.19
N$23
  Bottom 0.406: IC11.16 124.14,78.11 133.35,68.9 133.35,58.1 134.3,57.15 140.34,57.15 142.24,59.05 IC14.10
N$24
  Bottom 0.406: IC11.15 124.14,75.56 130.81,68.9 130.81,58.1 133.03,55.88 136.21,55.88 139.7,52.39 IC14.6
N$25
  Bottom 0.406: IC11.12 118.75,67.94 125.73,60.96 125.73,58.42 IC14.3
N$26
  Top 0.406: IC11.2 102.87,80.64 102.87,67.31 109.22,60.96 109.22,50.48 124.46,35.24 130.18,35.24 132.08,37.15 IC13.3
N$27
  Top 0.406: IC6.5 51.12,86.36 49.21,88.27 42.86,88.27 39.05,84.45 39.05,38.1 46.04,31.11 46.04,26.67 49.21,23.5 71.44,23.5 79.06,15.88 95.89,15.88 97.79,17.78 IC9.6
N$28  (via drill 0.61 pad 1.27)
  Top 0.406: IC13.10 142.24,45.09 138.11,40.96 134.62,40.96 133.35,39.69 133.35,35.56 132.08,34.29 121.6,34.29 106.68,49.21 106.68,53.98 104.14,56.52 104.14,62.55 99.38,67.31 v99.38,68.9
  Bottom 0.406: v99.38,68.9 106.05,75.56 IC11.6
N$29
  Top 0.406: IC15.12 25.4,17.14 25.4,33.02 26.67,34.29 IC3.5
N$30
  Bottom 0.406: IC11.9 109.22,66.67 118.75,66.67 124.78,60.64 124.78,50.16 127.32,47.62 132.72,47.62 IC13.13
N$31
  Top 0.406: IC2.5 26.67,48.58 27.94,47.31 27.94,34.29 26.67,33.02 IC16.12
N$32
  Top 0.406: IC2.3 21.59,48.58 22.86,47.31 22.86,34.29 21.59,33.02 IC16.14
N$33
  Top 0.406: IC2.4 24.13,48.58 25.4,47.31 25.4,34.29 24.13,33.02 IC16.13
N$34
  Top 0.406: IC2.6 29.21,48.58 30.48,47.31 30.48,34.29 29.21,33.02 IC16.11
N$35
  Top 0.406: IC15.14 20.32,17.14 20.32,33.02 21.59,34.29 IC3.3
N$36
  Top 0.406: IC15.13 22.86,17.14 22.86,33.02 24.13,34.29 IC3.4
N$37
  Top 0.406: IC15.11 27.94,17.14 27.94,33.02 29.21,34.29 IC3.6
N$38
  Top 0.406: IC9.8 101.6,25.4 101.6,15.88 99.69,13.97 66.99,13.97 58.1,5.08 24.13,5.08 22.86,6.35 22.86,9.53 17.78,14.61 17.78,33.02 16.51,34.29 IC3.1
  Bottom 0.406: IC3.1 15.24,38.1 15.24,50.8 IC2.1
N$47
  Top 0.406: IC12.5 113.35,49.21 124.14,49.21 IC14.1 128.27,50.8 128.27,39.37 IC13.1
N$57
  Bottom 0.406: IC6.4 53.66,85.41 56.83,88.58 74.3,88.58 76.2,86.68 IC5.19
N$58
  Bottom 0.406: IC6.3 58.74,87.63 73.98,87.63 74.93,86.68 74.93,83.5 75.88,82.55 81.92,82.55 83.82,84.45 IC5.16
N$59
  Bottom 0.406: IC5.15 86.36,84.45 83.5,81.6 73.34,81.6 72.39,82.55 61.28,82.55 IC6.2
N$60
  Top 0.406: IC5.12 91.44,82.55 63.82,82.55 IC6.1
N$61
  Top 0.406: IC5.9 89.85,81.6 56.2,81.6 53.66,79.06 IC6.13
N$62
  Top 0.406: IC6.12 51.12,75.88 51.75,75.25 54.29,75.25 54.93,75.88 54.93,79.06 56.52,80.64 83.82,80.64 86.36,78.11 IC5.6
N$63
  Bottom 0.406: IC5.5 83.82,78.11 82.23,79.69 75.56,79.69 74.93,79.06 74.93,75.88 73.98,74.93 50.48,74.93 48.58,76.83 IC6.11
N$64
  Bottom 0.406: IC5.2 76.2,75.88 74.3,73.98 48.9,73.98 46.04,76.83 IC6.10
OP0
  Top 0.406: JP7.9 149.54,35.88 136.53,35.88 134.62,37.78 IC13.4
OP1
  Top 0.406: JP7.8 146.05,42.23 142.24,38.42 IC13.7
OP2
  Top 0.406: JP7.7 145.73,44.77 IC13.9
OP3
  Top 0.406: JP7.6 152.08,47.31 151.45,47.94 139.38,47.94 IC13.12
OP4
  Top 0.406: JP7.5 136.84,49.85 IC14.4
OP5
  Top 0.406: JP7.4 152.08,52.39 150.18,54.29 144.46,54.29 IC14.7
OP6
  Top 0.406: JP7.3 152.08,54.93 147.32,59.69 IC14.9
OP7
  Top 0.406: JP7.2 150.81,57.47 146.37,61.91 139.38,61.91 IC14.12
OP8
  Top 0.406: JP7.1 149.54,60.01 146.69,62.87 123.83,62.87 117.47,56.52 117.47,51.12 116.52,50.16 114.62,50.16 113.03,51.75 IC12.6
PROT
  Top 0.406: JP10.21 103.5,10.16 111.76,10.16 116.84,15.24 IC4.10
RST  (via drill 0.61 pad 1.27)
  Top 0.406: IC10.15 77.47,58.42 77.47,44.45 v85.41,36.51 | v97.16,36.51 v107.95,25.72
  Bottom 0.406: v85.41,36.51 v97.16,36.51 | v107.95,25.72 107.95,17.14 JP10.9

### Text on the board
Top: #2
tsilk: VCC2 | GND1 | IC11 | 74LS273N | JP3 | JP1 | IC6 | 74LS148N | 74LS273N | IC5 | JP8 | RN1 | JP7 | 74LS163 | 74LS08N | 74LS173N | 74LS74N | 74LS157N | IC2 | IC8 | IC10 | IC12 | IC14 | 74LS157N | 74LS163 | 74LS148N | IC13 | IC3 | IC7 | JP4 | JP2 | IC1 | IC16 | IC4 | 74LS08N | 74LS163 | 74LS00N | 74LS32N | IC9 | 74LS163 | 74LS04N | GND2 | VCC1 | IC15 | IC17 | JP10